# Altium project PCB_Project.PrjPcb
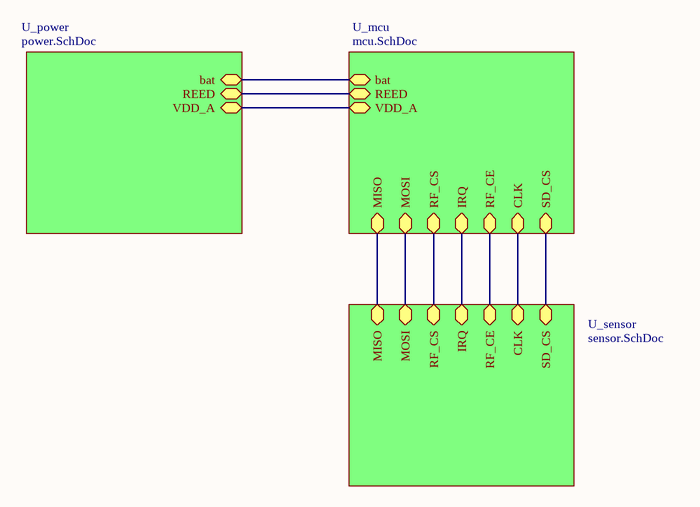
[diagram p0: Main.SchDoc]
4 sheets, 51 parts. Net scope: hierarchical (ports join the sheet entries above them; power ports are global).
Board file: PCB1.PcbDoc
Sheets:
  Main.SchDoc
    U_power = power.SchDoc
    U_mcu = mcu.SchDoc
    U_sensor = sensor.SchDoc

## Sheet Main.SchDoc
size A4

### Sub-sheets
U_mcu = mcu.SchDoc: bat, MISO, MOSI, RF_CS, IRQ, RF_CE, CLK, SD_CS, REED, VDD_A
U_power = power.SchDoc: bat, REED, VDD_A
U_sensor = sensor.SchDoc: MISO, MOSI, RF_CS, IRQ, RF_CE, CLK, SD_CS

### Nets
bat: sheet U_power/bat, sheet U_mcu/bat
CLK: sheet U_mcu/CLK, sheet U_sensor/CLK
IRQ: sheet U_mcu/IRQ, sheet U_sensor/IRQ
MISO: sheet U_mcu/MISO, sheet U_sensor/MISO
MOSI: sheet U_mcu/MOSI, sheet U_sensor/MOSI
REED: sheet U_power/REED, sheet U_mcu/REED
RF_CE: sheet U_mcu/RF_CE, sheet U_sensor/RF_CE
RF_CS: sheet U_mcu/RF_CS, sheet U_sensor/RF_CS
SD_CS: sheet U_mcu/SD_CS, sheet U_sensor/SD_CS
VDD_A: sheet U_power/VDD_A, sheet U_mcu/VDD_A

## Sheet power.SchDoc
size A4
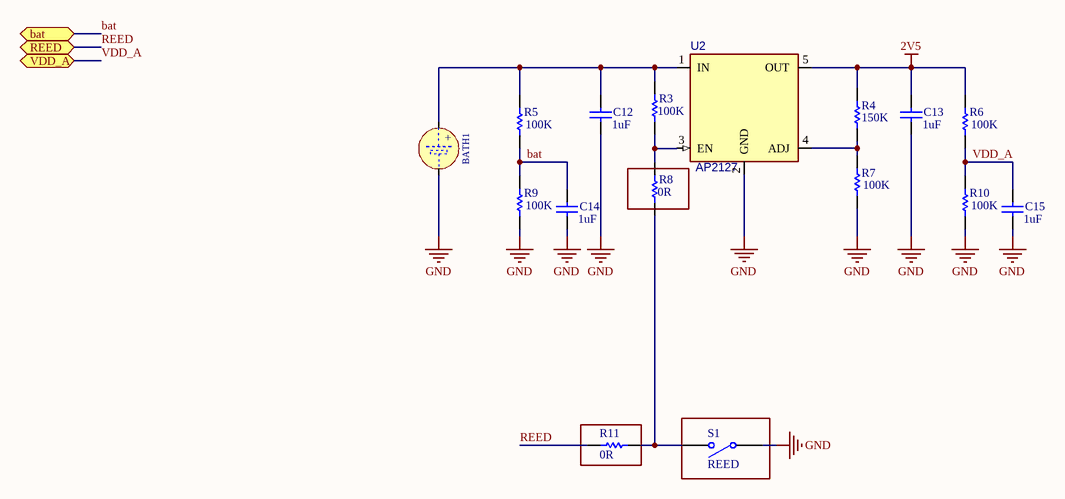
[diagram p1: power.SchDoc]

### Parts
BATH1  (no value)  [BATH_KEYSTONE_3000]
C12  value 1uF  [0805]  (hidden comment: C0805)
C13  value 1uF  [0805]  (hidden comment: C0805)
C14  value 1uF  [0805]  (hidden comment: C0805)
C15  value 1uF  [0805]  (hidden comment: C0805)
R3  value 100K  [ERA-0805]  (hidden comment: ERA6Y)
R4  value 150K  [ERA-0805]  (hidden comment: ERA6Y)
R5  value 100K  [ERA-0805]  (hidden comment: ERA6Y)
R6  value 100K  [ERA-0805]  (hidden comment: ERA6Y)
R7  value 100K  [ERA-0805]  (hidden comment: ERA6Y)
R8  value 0R  [ERA-0805]  (hidden comment: ERA6Y)
R9  value 100K  [ERA-0805]  (hidden comment: ERA6Y)
R10  value 100K  [ERA-0805]  (hidden comment: ERA6Y)
R11  value 0R  [ERA-0805]  (hidden comment: ERA6Y)
S1  REED  [SPST-2]
U2  value AP2127  [SOT-25]  (hidden comment: 000000)

### Ports
bat, REED, VDD_A

### Nets
2V5: C13.2 R4.2 R6.2 U2.5(OUT)
GND: BATH1.2(MINUS) C12.1 C13.1 C14.1 C15.1 R7.1 R9.1 R10.1 S1.1(COMMON) U2.2(GND)
bat: C14.2 R5.1 R9.2 ; port bat
REED: R11.2 ; port REED
VDD_A: C15.2 R6.1 R10.2 ; port VDD_A
NetBATH1_1: BATH1.1(PLUS) C12.2 R3.2 R5.2 U2.1(IN)
NetR3_1: R3.1 R8.2 U2.3(EN)
NetR4_1: R4.1 R7.2 U2.4(ADJ)
NetR8_1: R8.1 R11.1 S1.2(NO)

### Notes on the sheet
- (in symbol BATH_KEYSTONE_3000) +

### Library data of the parts
BATH1 = BATH_KEYSTONE_3000: Battery Holder whit 2 Pin; Part Description: SMD Battery Holders for BR1216, CR1216, BR1220, CL1220, CR1220, BR1225 Coin Cells; Manufacturer Part Number: 3000; Table: Batteries; Part Number: BATH_KEYSTONE_3000; Component Kind: Standard; Component Type: Standard; Pin Count: 3; PackageDescription: SMD Battery Holders for BR1216, CR1216, BR1220, CL1220, CR1220, BR1225 Coin Cells; Family: Battery; Mounted: Yes; Socket: No; SMD: No; Manufacturer: KEYSTONE; ComponentHeight: 3.17mm; HelpURL: \\cern.ch\dfs\Applications\Altium\Datasheets\BATH_KEYSTONE_3000.pdf; Author: CERN DEM JLC; CreateDate: 17.04.2012; LatestRevisionDate: 17.04.2012
C12-C15 = C0805: Ceramic Chip Capacitor - Standard; Note: Footprint corresponds to dimensions for bulk cassette packaging. This case size has tightened tolerances.; Published: 17-Jul-2002; LatestRevisionDate: 19-Mar-2004; LatestRevisionNote: Silkscreen size reduced.; DatasheetDocument: Mar-2001; PackageDocument: Mar-2001; PackageReference: 0805; Publisher: Altium Limited; Code_JEITA: 0805; Code_IPC: 2012[0805]; ComponentLink1Description: Manufacturer Link; ComponentLink1URL: http://www.kemet.com/; ComponentLink2Description: Datasheet; ComponentLink2URL: http://www.kemet.com/kemet/web/homepage/kechome.nsf/vapubfilesname/F3102TA.pdf/$file/F3102TA.pdf
R3-R11 = ERA6Y: Rectangular Thick Film Chip Resistor, 10 Ohm to 1M Ohm Range, 0.1% and 0.5% Tolerance, 0805 Size, 0.1 W; Note: If flow soldering, adjust pad width of PCB Footprint to 0.7 - 0.8 times the width of the resistor.; Published: 17-Dec-2003; LatestRevisionDate: 19-Mar-2004; LatestRevisionNote: Silkscreen size reduced.; PackageDocument: Mar-2003; PackageReference: ERA-0805; Publisher: Altium Limited; Code_IPC: 2012 [0805]; ComponentLink1Description: Manufacturer Link; ComponentLink1URL: http://www.panasonic.com/industrial/components/resistive_products.htm; ComponentLink2Description: Datasheet; ComponentLink2URL: http://www.panasonic.com/industrial/components/pdf/AOA0000CE8.pdf
S1 = SW-SPST: Single-Pole, Single-Throw Switch; Published: 24-Mar-1999; LatestRevisionDate: 17-Jul-2002; LatestRevisionNote: Re-released for DXP Platform.; PackageReference: SPST-2; Publisher: Altium Limited; PackageDescription: Switch; 2 Leads
U2 = AP7331-WG: LDO 300mA,  Low Quiescent Current, Fast Transient; Package: SOT23-5; PN: 000000; ExtraInfo: *

## Sheet mcu.SchDoc
size A4
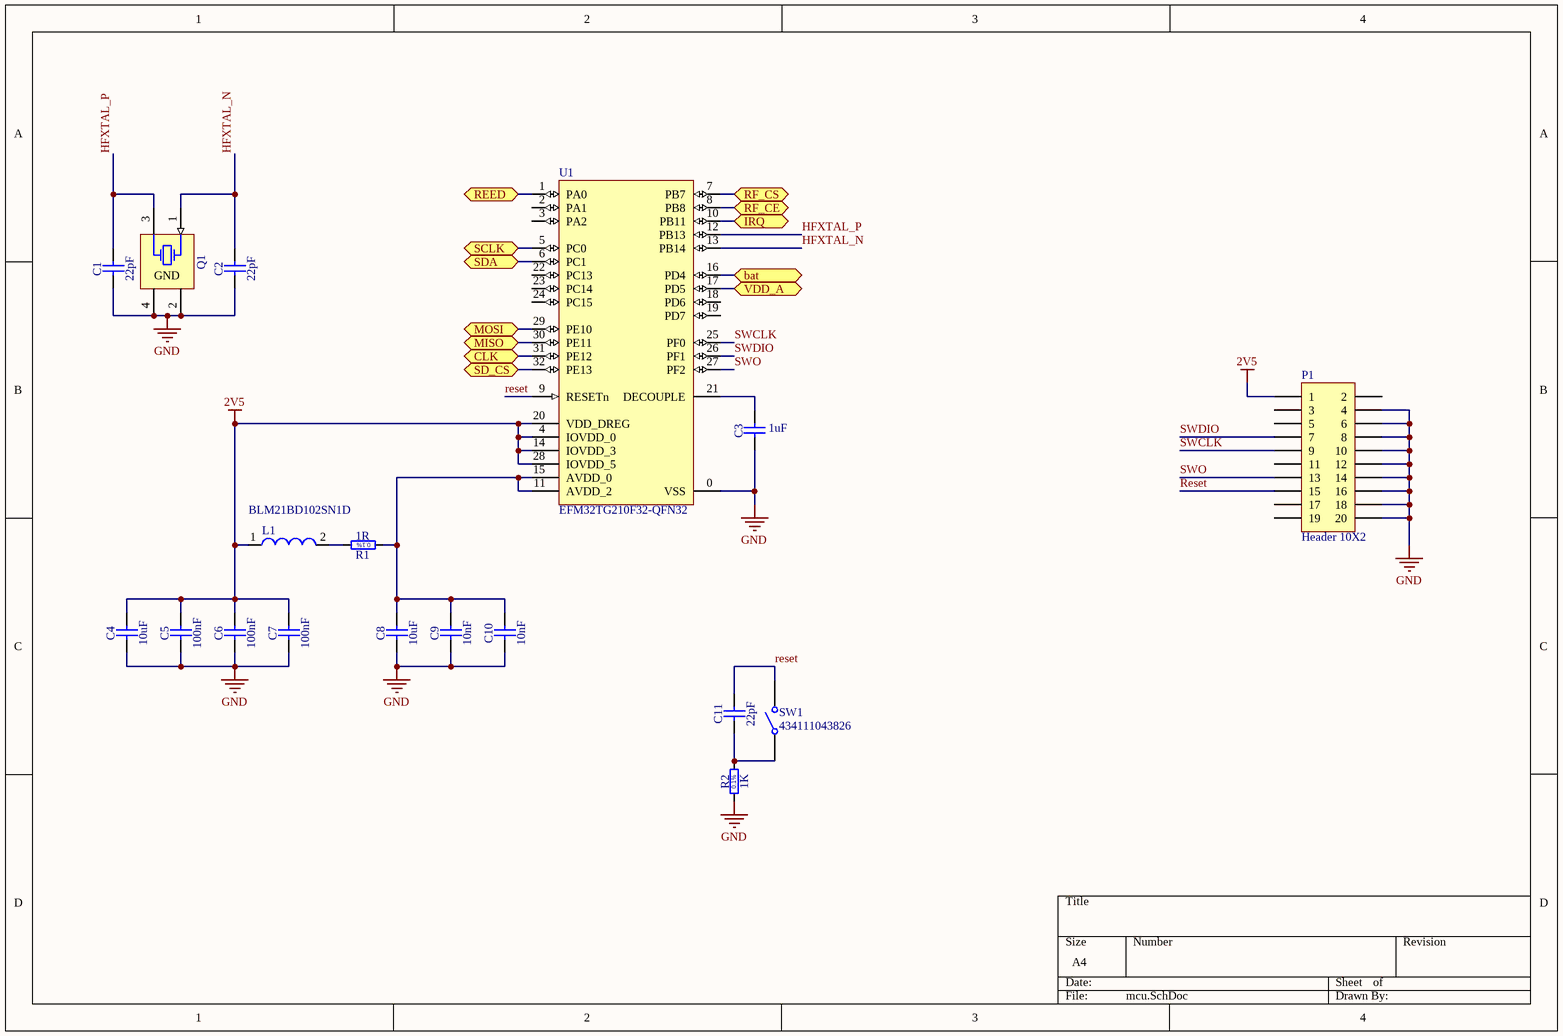
[diagram p2: mcu.SchDoc]

### Parts
C1  22pF  [CAPC2012X135N]
C2  22pF  [CAPC2012X135N]
C3  1uF  [CAPC2012X135N]
C4  10uF  [CAPC2012X135N]
C5  100nF  [CAPC2012X135N]
C6  100nF  [CAPC2012X135N]
C7  100nF  [CAPC2012X135N]
C8  10uF  [CAPC2012X135N]
C9  10nF  [CAPC2012X135N]
C10  10nF  [CAPC2012X135N]
C11  22pF  [CAPC2012X135N]
L1  BLM21BD102SN1D  [6-0805]
P1  Header 10X2  [HDR2X10]
Q1  25MHz  [XTAL_EPSON_TSX-3225]  (value not drawn)
R1  1R  [RESC2012X60N]
R2  1K  [RESC2012X60N]
SW1  434111043826  [434111043826]
U1  EFM32TG210F32-QFN32  [ENMR-QFN32_N]

### Ports
bat, CLK, IRQ, MISO, MOSI, REED, RF_CE, RF_CS, SCLK, SD_CS, SDA, VDD_A

### Nets
2V5: C4.2 C5.2 C6.2 C7.2 L1.1 P1.1 U1.4(IOVDD_0) U1.14(IOVDD_3) U1.20(VDD_DREG) U1.28(IOVDD_5)
GND: C1.1 C2.1 C3.1 C4.1 C5.1 C6.1 C7.1 C8.1 C9.1 C10.1 P1.4 P1.6 P1.8 P1.10 P1.12 P1.14 P1.16 P1.18 P1.20 Q1.2(GND) Q1.4(GND) R2.1 U1.0(VSS)
bat: U1.16(PD4) ; port bat
CLK: U1.31(PE12) ; port CLK
HFXTAL_N: C2.2 Q1.1(X) U1.13(PB14)
HFXTAL_P: C1.2 Q1.3(X) U1.12(PB13)
IRQ: U1.10(PB11) ; port IRQ
MISO: U1.30(PE11) ; port MISO
MOSI: U1.29(PE10) ; port MOSI
REED: U1.1(PA0) ; port REED
Reset: C11.2 P1.15 SW1.2 U1.9(RESETn)
RF_CE: U1.8(PB8) ; port RF_CE
RF_CS: U1.7(PB7) ; port RF_CS
SD_CS: U1.32(PE13) ; port SD_CS
SWCLK: P1.9 U1.25(PF0)
SWDIO: P1.7 U1.26(PF1)
SWO: P1.13 U1.27(PF2)
VDD_A: U1.17(PD5) ; port VDD_A
NetC3_2: C3.2 U1.21(DECOUPLE)
NetC8_2: C8.2 C9.2 C10.2 R1.1 U1.11(AVDD_2) U1.15(AVDD_0)
NetC11_1: C11.1 R2.2 SW1.1
NetL1_2: L1.2 R1.2
NetU1_5: U1.5(PC0) ; port SCLK
NetU1_6: U1.6(PC1) ; port SDA

Not connected (* = marked no-connect by the designer): P1 2 3 5 11 17 19; U1 2(PA1) 3(PA2) 18(PD6) 19(PD7) 22(PC13) 23(PC14) 24(PC15)

### Notes on the sheet
- (in symbol R0805_1K1_0.1%_0.1W_10PPM) 0.1%

### Library data of the parts
C1 C2 C4-C11 = CC0805_10NF_50V_10%_X7R: Non-polarised capacitor; Part Description: SMD Multilayer Chip Ceramic Capacitor; Manufacturer: GENERIC; Manufacturer1 Part Number: B37941K5103K60; Voltage: 50V; TC: X7R; Tolerance: ±10%; Table: Capacitors SMD; Part Number: CC0805_10NF_50V_10%_X7R; Component Kind: Standard; Component Type: Standard; Pin Count: 2; Status: Preferred; Manufacturer Part Number: CC0805_10NF_50V_10%_X7R; Case: 0805; Mounted: Yes; Socket: No; SMD: Yes; Manufacturer1 Example: EPCOS; Manufacturer1 ComponentHeight: 1.35mm; HelpURL: \\cern.ch\dfs\Applications\Altium\Datasheets\CC0805_X7R_EPCOS.pdf; Author: CERN DEM JLC; CreateDate: 03.12.2007; LatestRevisionDate: 03.12.2007
  C1 C2 C11: Value: 22pF
  C4 C8: Value: 10uF
  C5-C7: Value: 100nF
  C9 C10: Value: 10nF
C3 = CC0805_1NF_50V_5%_X7R: Non-polarised capacitor; Part Description: SMD Multilayer Chip Ceramic Capacitor; Manufacturer: GENERIC; Manufacturer1 Part Number: 08055C102JAT2A; Voltage: 50V; TC: X7R; Tolerance: ±5%; Table: Capacitors SMD; Part Number: CC0805_1NF_50V_5%_X7R; Component Kind: Standard; Component Type: Standard; Pin Count: 2; Value: 1uF; Status: None; Manufacturer Part Number: CC0805_1NF_50V_5%_X7R; Case: 0805; Mounted: Yes; Socket: No; SMD: Yes; Manufacturer1 Example: AVX; Manufacturer1 ComponentHeight: 0.94mm; HelpURL: \\cern.ch\dfs\Applications\Altium\Datasheets\CC0805_X7R_AVX.pdf; Author: CERN DEM JLC; CreateDate: 18.01.2011; LatestRevisionDate: 18.01.2011
L1 = 7427920: SMD EMI Suppression Ferrite Bead WE-CBF, Z = 11 Ohm; Impedance: 11 Ohm; DatasheetVersion: Dec-2005; PackageReference: SMD-0805; PackageDescription: Chip Inductor, 2-Leads, Body 2.0 x 1.2 mm; PartNumber: 7427920; ComponentLink1Description: Manufacturer URL; ComponentLink1URL: http://www.we-online.com; ComponentLink2Description: Datasheet; ComponentLink2URL: http://www.we-online.de/katalog/media/pdf/7427920.pdf
P1 = Header 10X2: Header, 10-Pin, Dual row; LatestRevisionDate: 17-Jul-2002; LatestRevisionNote: Re-released for DXP Platform.; Publisher: Altium Limited
Q1 = XTAL_25MHZ_EPSON_TSX-322525.0000MF10Z-AC: Crystal 4 pins 1=XTAL Control 2=GND3=XTAL 4=GND; Part Description: Tolerance ±10 ppm,  Stability:± 10ppm, -20°C to 75°C, 9pF, Surface Mount Quartz Crystal, TX-3225 Serie; Manufacturer: EPSON; Table: Crystals & Oscillators; Part Number: XTAL_25MHZ_EPSON_TSX-322525.0000MF10Z-AC; Component Kind: Standard; Component Type: Standard; PackageDescription: Oscillator TSX-3225 Serie, Corner Concave; 4 pin, 2.50mm L X 3.2mm W X 0.6mm H; Value: 25MHz; Manufacturer Part Number: TSX-322525.0000MF10Z-AC; Pin Count: 4; Mounted: Yes; Socket: No; SMD: Yes; ComponentHeight: 0.6mm; HelpURL: \\cern.ch\dfs\Applications\Altium\Datasheets\XTAL_EPSON_TSX-3225.pdf; ComponentLink1URL: \\cern.ch\dfs\Applications\Altium\Datasheets\XTAL_EPSON_TSX-3225_Ordering-Informations.pdf; ComponentLink1Description: Ordering Informations; Author: CERN DEM JLC; CreateDate: 03.04.2012; LatestRevisionDate: 03.04.2012
R1 R2 = R0805_1K1_0.1%_0.1W_10PPM: Resistor - 0.1%; Part Description: Thin Film Chip Resistor; Manufacturer: GENERIC; Manufacturer1 Part Number: RN73C2A1K1BTG; Power: 0.1W; TC: ±10ppm; Table: Resistors SMD; Part Number: R0805_1K1_0.1%_0.1W_10PPM; Component Kind: Standard; Component Type: Standard; Pin Count: 2; Status: Not recommended; Tolerance: ±0.1%; Manufacturer Part Number: R0805_1K1_0.1%_0.1W_10PPM; Case: 0805; Mounted: Yes; Socket: No; SMD: Yes; Manufacturer1 Example: TYCO HOLSWORTHY; Manufacturer1 ComponentHeight: 0.6mm; HelpURL: \\cern.ch\dfs\Applications\Altium\Datasheets\R0805_Tyco_RN73.pdf; Author: CERN DEM JLC; CreateDate: 03.12.2007; LatestRevisionDate: 13.03.2008
  R1: Value: 1R
  R2: Value: 1K
SW1 = 434111043826: WS-TASV SMD Tact Switch 6.0X3.5 mm; NoPins: 02; PackageReference: 434111043826; PartNumber: 434111043826; ComponentLink1Description: Manufacturer URL; ComponentLink1URL: http://www.we-online.com; ComponentLink2Description: Datasheet; ComponentLink2URL: http://katalog.we-online.de/em/datasheet/434111043826.pdf
U1 = EFM32TG210F32-QFN32: EFM32 Tiny Gecko, M3 ARM Cortex CPU, 32 KB Flash, 4 KB RAM, 1.85 - 3.8 V Supply, 32 MHz Max Speed, -40 to 85 degC, 32-Pin QFN, RoHS Compliant; ADC: Y; Flash (KB): 32; GPIO: 24; OPAMPS: 3; RAM (KB): 4; DatasheetVersion: Rev 1.00; PackageVersion: Rev. 98SPP32088A_XO1_10MAR2011; PackageReference: QFN32; PackageDescription: 32-Pin Quad Flat No Lead Package, Body 6 x 6 mm, Pitch 0.65 mm; Supplier 1: Digi-Key; Supplier Part Number 1: 914-1034-2-ND; Supplier 2: Digi-Key; Supplier Part Number 2: 914-1034-1-ND; Supplier 3: Digi-Key; Supplier Part Number 3: 914-1034-6-ND; Supplier 4: Mouser; Supplier Part Number 4: 904-EFM32TG210F32; AES: Y; ARM Cortex CPU: M3; LESENSE: Y; Max Speed (MHz): 32; Subcategory: EFM32 Tiny Gecko; Supply Voltage (V): 1.85 - 3.8; Mounting Technology: Surface Mount; Generic Part Number: EFM32TG210; PartNumber: EFM32TG210F32-QFN32; ComponentLink1Description: Manufacturer URL; ComponentLink1URL: http://www.energymicro.com/; ComponentLink2Description: Datasheet; ComponentLink2URL: http://cdn.energymicro.com/dl/devices/pdf/d0012_efm32tg210_datasheet.pdf; ComponentLink3Description: Package Specification; ComponentLink3URL: http://cdn.energymicro.com/dl/devices/pdf/d0004_efm32g210_datasheet.pdf

## Sheet sensor.SchDoc
size A4
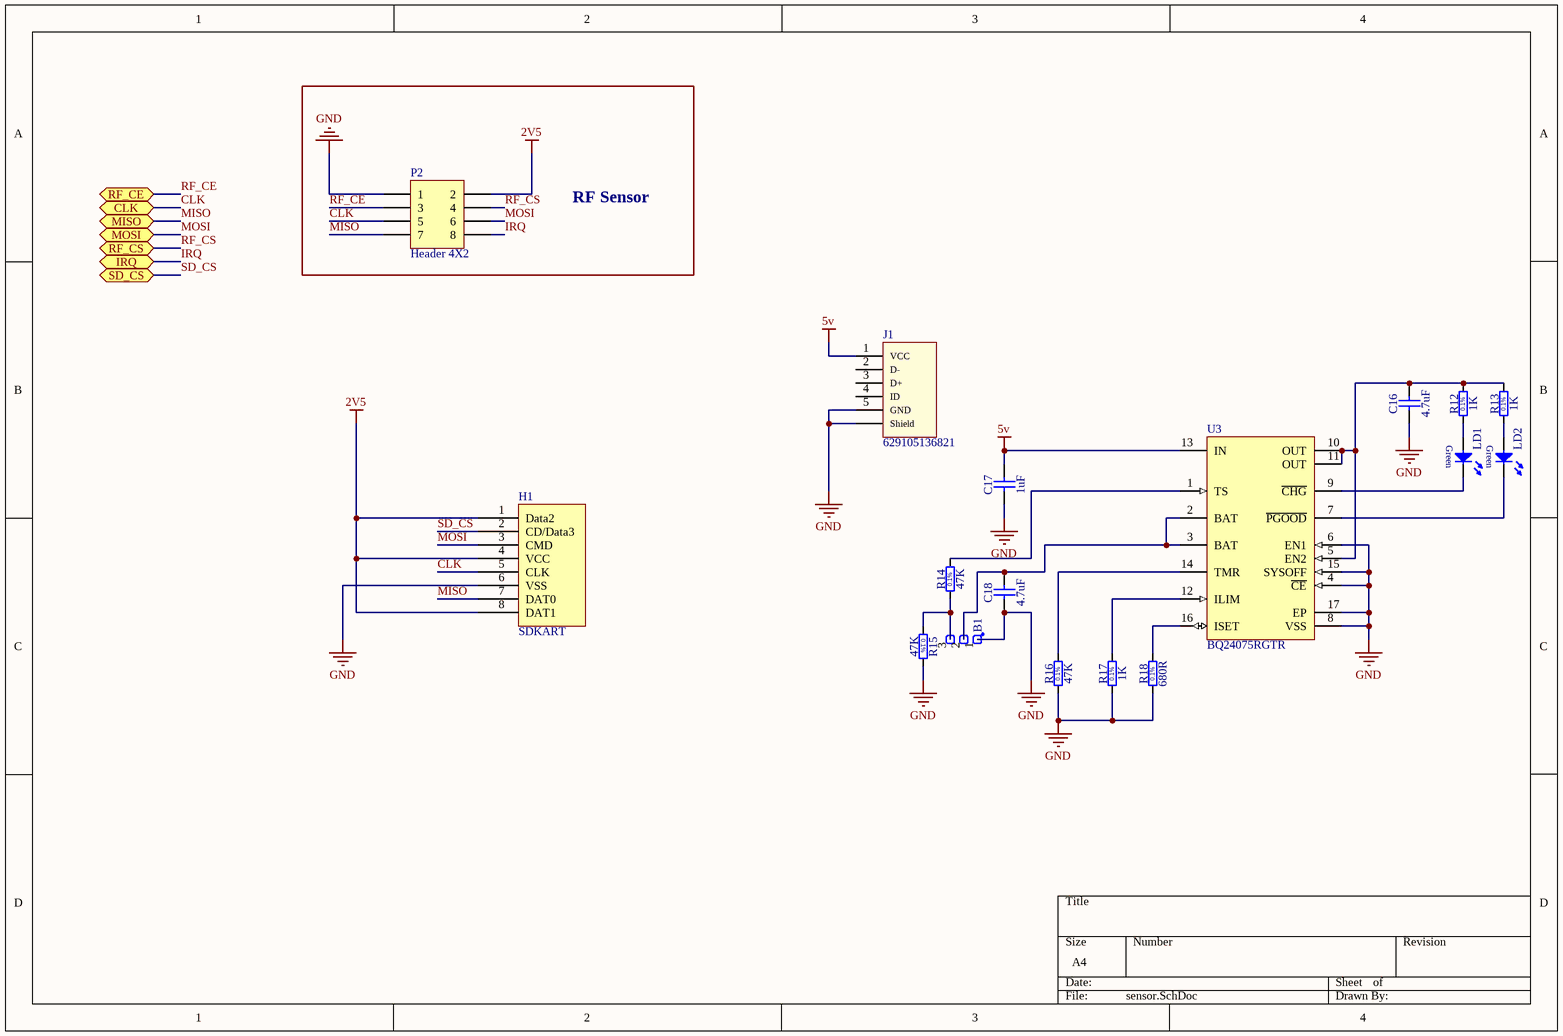
[diagram p3: sensor.SchDoc]

### Parts
B1  Test Point  [COMATEL_331.0600.1.03.500]  (value not drawn)
C16  4.7uF  [CAPC2012X135N]
C17  1uF  [CAPC2012X135N]
C18  4.7uF  [CAPC2012X135N]
H1  SDKART  [PCBComponent_1]
J1  629105136821  [629105136821]
LD1  Green  [LED_OSRAM_LGR971]  (value not drawn)
LD2  Green  [LED_OSRAM_LGR971]  (value not drawn)
P2  Header 4X2  [HDR2X4]
R12  1K  [RESC2012X60N]
R13  1K  [RESC2012X60N]
R14  47K  [RESC2012X60N]
R15  47K  [RESC2012X60N]
R16  47K  [RESC2012X60N]
R17  1K  [RESC2012X60N]
R18  680R  [RESC2012X60N]
U3  BQ24075RGTR  [RGT16-1700X1700TP]

### Blocks framed on the sheet
RF Sensor: P2

### Ports
CLK, IRQ, MISO, MOSI, RF_CE, RF_CS, SD_CS

### Nets
2V5: H1.1(Data2) H1.4(VCC) H1.8(DAT1) P2.2
5v: C17.2 J1.1(VCC) U3.13(IN)
GND: B1.1 C16.1 C17.1 C18.1 H1.6(VSS) J1.5(GND) J1.Shell(Shield) P2.1 R15.2 R16.1 R17.1 R18.1 U3.4(~{CE}) U3.6(EN1) U3.8(VSS) U3.15(SYSOFF) U3.17(EP)
CLK: H1.5(CLK) P2.5 ; port CLK
IRQ: P2.8 ; port IRQ
MISO: H1.7(DAT0) P2.7 ; port MISO
MOSI: H1.3(CMD) P2.6 ; port MOSI
RF_CE: P2.3 ; port RF_CE
RF_CS: P2.4 ; port RF_CS
SD_CS: H1.2(CD/Data3) ; port SD_CS
NetB1_2: B1.2 C18.2 U3.2(BAT) U3.3(BAT)
NetB1_3: B1.3 R14.1 R15.1
NetC16_2: C16.2 R12.2 R13.2 U3.5(EN2) U3.10(OUT) U3.11(OUT)
NetLD1_1: LD1.1(C) U3.9(~{CHG})
NetLD1_2: LD1.2(A) R12.1
NetLD2_1: LD2.1(C) U3.7(~{PGOOD})
NetLD2_2: LD2.2(A) R13.1
NetR14_2: R14.2 U3.1(TS)
NetR16_2: R16.2 U3.14(TMR)
NetR17_2: R17.2 U3.12(ILIM)
NetR18_2: R18.2 U3.16(ISET)

Not connected (* = marked no-connect by the designer): J1 2(D-) 3(D+) 4(ID)

### Notes on the sheet
- (in symbol R0805_1K1_0.1%_0.1W_10PPM) 0.1%

### Library data of the parts
B1 = COMATEL_331.0600.1.03.500: 3 Positions Terminal Strip; Part Description: 3 "U" Pins Strip Terminals Components Support, Pitch 2.54mm; Manufacturer: KONTEK COMATEL; Table: STELVIO-KONTEK COMATEL; Part Number: COMATEL_331.0600.1.03.500; Component Kind: Standard; Component Type: Standard; Pin Count: 3; Family: Test Point; Mounted: Yes; Socket: No; SMD: No; Status: Obsolete; Manufacturer Part Number: 331.0600.1.03.500; ComponentHeight: 5.7mm; HelpURL: \\cern.ch\dfs\Applications\Altium\Datasheets\COMATEL_331.0600.1.03.500.pdf; Author: CERN DEM JLC; CreateDate: 16.12.2010; LatestRevisionDate: 27.08.2013
C16-C18 = CC0805_10NF_50V_10%_X7R: as C1 on sheet mcu; Part Number: CC0805_10NF_50V_10%_X7R; Component Kind: Standard; Component Type: Standard; Pin Count: 2; Status: Preferred; Manufacturer Part Number: CC0805_10NF_50V_10%_X7R; Case: 0805; Mounted: Yes; Socket: No; SMD: Yes; Manufacturer1 Example: EPCOS; Manufacturer1 ComponentHeight: 1.35mm; HelpURL: \\cern.ch\dfs\Applications\Altium\Datasheets\CC0805_X7R_EPCOS.pdf; Author: CERN DEM JLC; CreateDate: 03.12.2007; LatestRevisionDate: 03.12.2007
  C16 C18: Value: 4.7uF
  C17: Value: 1uF
J1 = 629105136821: Micro USB 2.0 SMT Type B Horizontal 5 Contacts WR-COM; Interface Type: Type B; Gender: Receptacle; ComponentLink1Description: Manufacturer; ComponentLink1URL: http://www.we-online.de; ComponentLink2Description: Datasheet; ComponentLink2URL: http://katalog.we-online.de/em/datasheet/629105136821.pdf; Part Number: 629105136821; Published Date: April 2017; Publisher: Wurth Elektronik; Sub-Family: Micro USB 2.0; Type: Horizontal; Construction: SMT
LD1 LD2 = LED_OSRAM_LGR971: LED Green 1C 2A; Part Description: Surface Mount Green LED (0805 Case); Manufacturer: OSRAM; Manufacturer Part Number: LGR971; Table: LEDs & Displays; Part Number: LED_OSRAM_LGR971; Component Kind: Standard; Component Type: Standard; Color: Green; PackageDescription: Green Chip LED, 2-Leads, Body 2.0x1.25mm, IPC Medium Density; Pin Count: 2; Case: 0805; Mounted: Yes; Socket: No; SMD: Yes; ComponentHeight: 0.9mm; HelpURL: \\cern.ch\dfs\Applications\Altium\Datasheets\LED_OSRAM_LGR971.pdf; Author: CERN DEM JLC; CreateDate: 28.01.2009; LatestRevisionDate: 17.03.2010
P2 = Header 4X2: Header, 4-Pin, Dual row; LatestRevisionDate: 17-Jul-2002; LatestRevisionNote: Re-released for DXP Platform.; Publisher: Altium Limited
R12-R18 = R0805_1K1_0.1%_0.1W_10PPM: as R1 on sheet mcu; Part Number: R0805_1K1_0.1%_0.1W_10PPM; Component Kind: Standard; Component Type: Standard; Pin Count: 2; Status: Not recommended; Tolerance: ±0.1%; Manufacturer Part Number: R0805_1K1_0.1%_0.1W_10PPM; Case: 0805; Mounted: Yes; Socket: No; SMD: Yes; Manufacturer1 Example: TYCO HOLSWORTHY; Manufacturer1 ComponentHeight: 0.6mm; HelpURL: \\cern.ch\dfs\Applications\Altium\Datasheets\R0805_Tyco_RN73.pdf; Author: CERN DEM JLC; CreateDate: 03.12.2007; LatestRevisionDate: 13.03.2008
  R12 R13 R17: Value: 1K
  R14-R16: Value: 47K
  R18: Value: 680R
U3 = BQ24075RGTR: USB-Friendly Li-Ion Battery Charger and Power-Path Management IC, Vout 5.5 V, 4.3 V, -40 to 85 degC, 16-pin QFN (RGT), Green (RoHS & no Sb/Br); Manufacturer: Texas Instruments; Lead Acid: N; SubFamily: Battery Charge Management; Vin(Min)(V): 4.3; DatasheetVersion: SLUS810G; PackageVersion: revH, Oct-2011; PackageReference: RGT16-1700X1700TP; PackageDescription: 16-Pin Plastic Quad Flat No-Lead, 3 x 3 mm Body, 0.5 mm Pitch, 1.7 x 1.7 mm Exposed Pad; Supplier 1: Digi-Key; Supplier Part Number 1: BQ24075RGTR-ND; Supplier 2: Newark; Supplier Part Number 2: 31P7535; Supplier 3: Mouser; Supplier Part Number 3: 595-BQ24075RGTR; Eco-Plan: Green (RoHS & no Sb/Br); Li-Ion: N; Li-Polymer: N; NiCd: N; NiMH: N; Over Voltage Protection: N; Mounting Technology: Surface Mount; PartNumber: BQ24075RGTR; Code_JEDEC: MO-220; ComponentLink1Description: Datasheet; ComponentLink1URL: http://www.ti.com/general/docs/lit/getliterature.tsp?genericPartNumber=BQ24075&fileType=pdf

## Nets that join several sheets
2V5: power (C13.2 R4.2 R6.2 U2.5), mcu (10 pins), sensor (H1.1 H1.4 H1.8 P2.2)
GND: power (10 pins), mcu (23 pins), sensor (17 pins)
bat: power (C14.2 R5.1 R9.2), mcu (U1.16)
CLK: mcu (U1.31), sensor (H1.5 P2.5)
IRQ: mcu (U1.10), sensor (P2.8)
MISO: mcu (U1.30), sensor (H1.7 P2.7)
MOSI: mcu (U1.29), sensor (H1.3 P2.6)
REED: power (R11.2), mcu (U1.1)
RF_CE: mcu (U1.8), sensor (P2.3)
RF_CS: mcu (U1.7), sensor (P2.4)
SD_CS: mcu (U1.32), sensor (H1.2)
VDD_A: power (C15.2 R6.1 R10.2), mcu (U1.17)